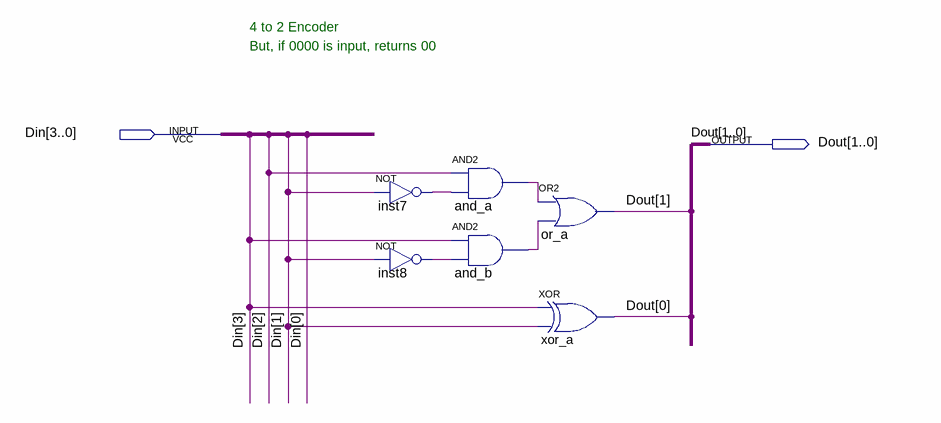
[diagram p0: schematic sheet]
// Quartus schematic OneHotDecoder2.bdf as structural Verilog: 6 symbols, 2 pins
module OneHotDecoder2 (
  input  [3:0] Din,
  output [1:0] Dout
);

  wire and_a_out, and_b_out, inst7_out, inst8_out;

  not inst7 (inst7_out, Din[1]);
  not inst8 (inst8_out, Din[1]);
  and and_a (and_a_out, Din[2], inst7_out);
  and and_b (and_b_out, Din[3], inst8_out);
  or or_a (Dout[1], and_a_out, and_b_out);
  xor xor_a (Dout[0], Din[3], Din[1]);

  // Notes on the sheet:
  //   4 to 2 Encoder
  //   But, if 0000 is input, returns 00
endmodule
